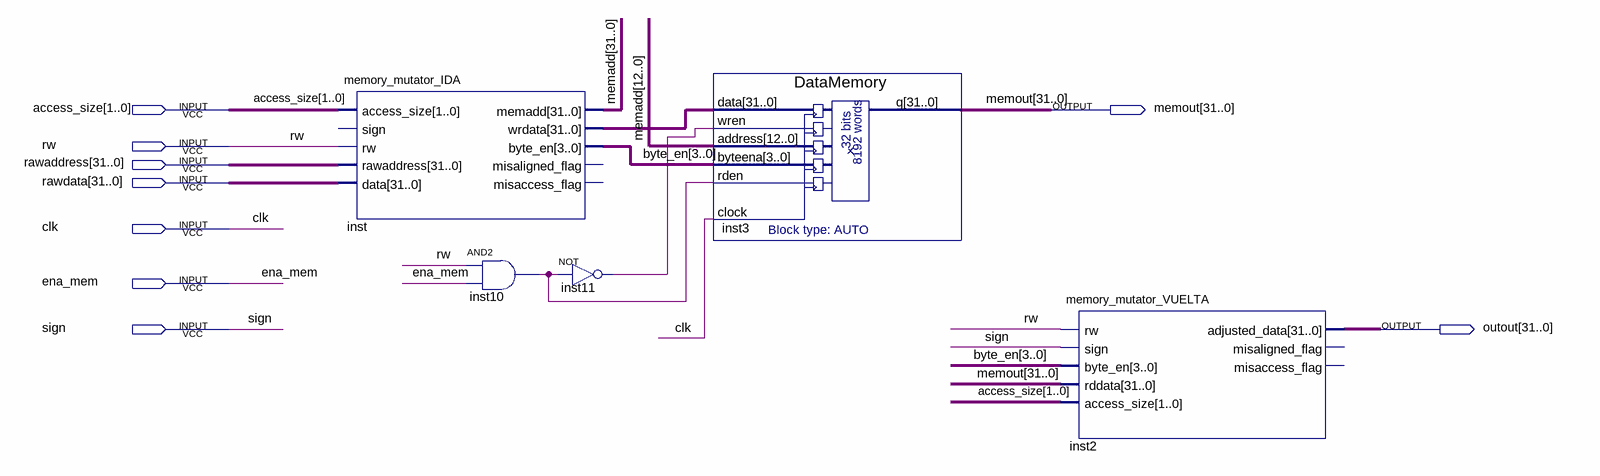
[diagram p0: schematic sheet]
// Quartus schematic dataMem_test.bdf as structural Verilog: 5 symbols, 9 pins
module dataMem_test (
  input  [1:0] access_size,
  input  rw,
  input  [31:0] rawaddress,
  input  [31:0] rawdata,
  input  clk,
  input  ena_mem,
  input  sign,
  output [31:0] memout,
  output [31:0] outout
);

  wire inst10_out, inst11_out;
  wire [3:0] byte_en;
  wire [31:0] inst_wrdata, memadd;

  memory_mutator_IDA inst (
    .access_size(access_size), .rw(rw), .rawaddress(rawaddress), .data(rawdata), .memadd(memadd),
    .wrdata(inst_wrdata), .byte_en(byte_en));  // open: sign, misaligned_flag, misaccess_flag
  and inst10 (inst10_out, rw, ena_mem);
  not inst11 (inst11_out, inst10_out);
  DataMemory inst3 (
    .data(inst_wrdata), .wren(inst11_out), .address(memadd[12:0]), .byteena(byte_en), .rden(inst10_out),
    .clock(clk), .q(memout));
  memory_mutator_VUELTA inst2 (
    .rw(rw), .sign(sign), .byte_en(byte_en), .rddata(memout), .access_size(access_size),
    .adjusted_data(outout));  // open: misaligned_flag, misaccess_flag
endmodule
